# EAGLE design boxiangf-TH (EAGLE 9.6.2)
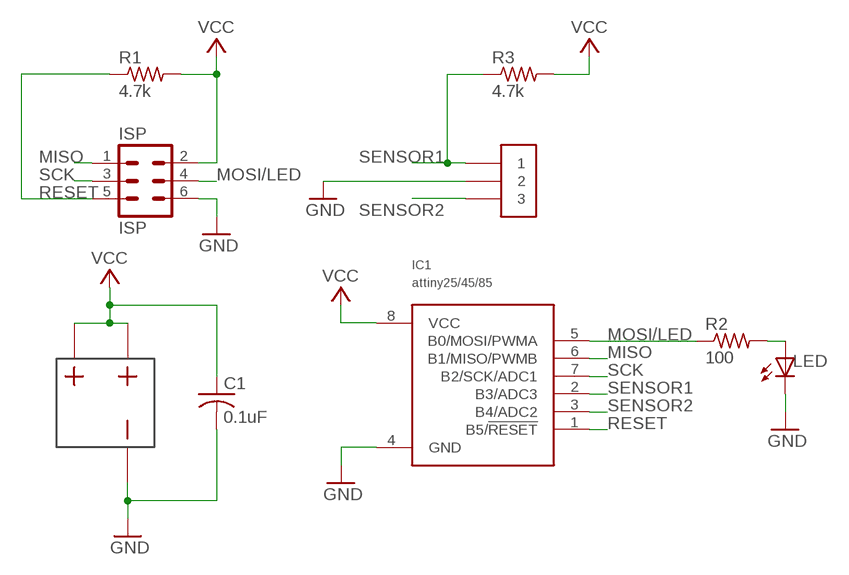
[diagram p0: schematic, sheet 1]

## Parts
C1  0.1uF  CAPACITORTH_CAP  [C025-025X050]
IC1  attiny25/45/85  ATTINY25TH_ATTINY  [DIL08]
ISP  ISP  6PINCON_ISPTH_6PIN  [6P2R0.1IN]
LED  LEDTH_LED  [LED5MM]
R1  4.7k  RESISTORTH_RESISTOR  [0204/7]
R2  100  RESISTORTH_RESISTOR  [0204/7]
R3  4.7k  RESISTORTH_RESISTOR  [0204/7]
SENSE  3PINCONTH_3PIN  [PUSHCON3]
US1  BATTERYTH_BA2032  [BA2032]

## Nets
GND: C1.2 IC1.4(GND) ISP.6 LED.K(C) SENSE.2 US1.P$1
MISO: IC1.6(B1/MISO/PWMB) ISP.1
MOSI/LED: IC1.5(B0/MOSI/PWMA) ISP.4 R2.1
N$2: LED.A R2.2
RESET: IC1.1(B5/!RESET) ISP.5 R1.1
SCK: IC1.7(B2/SCK/ADC1) ISP.3
SENSOR1: IC1.2(B3/ADC3) R3.1 SENSE.1
SENSOR2: IC1.3(B4/ADC2) SENSE.3
VCC: C1.1 IC1.8(VCC) ISP.2 R1.2 R3.2 US1.P$2 US1.P$3

## Library data of the parts
C1 = TinyGadget:CAPACITOR
IC1 = TinyGadget:ATTINY25
ISP = TinyGadget:6PINCON_ISP
LED = TinyGadget:LED
R1-R3 = TinyGadget:RESISTOR
SENSE = TinyGadget:3PINCON
US1 = TinyGadget:BATTERY

## Board
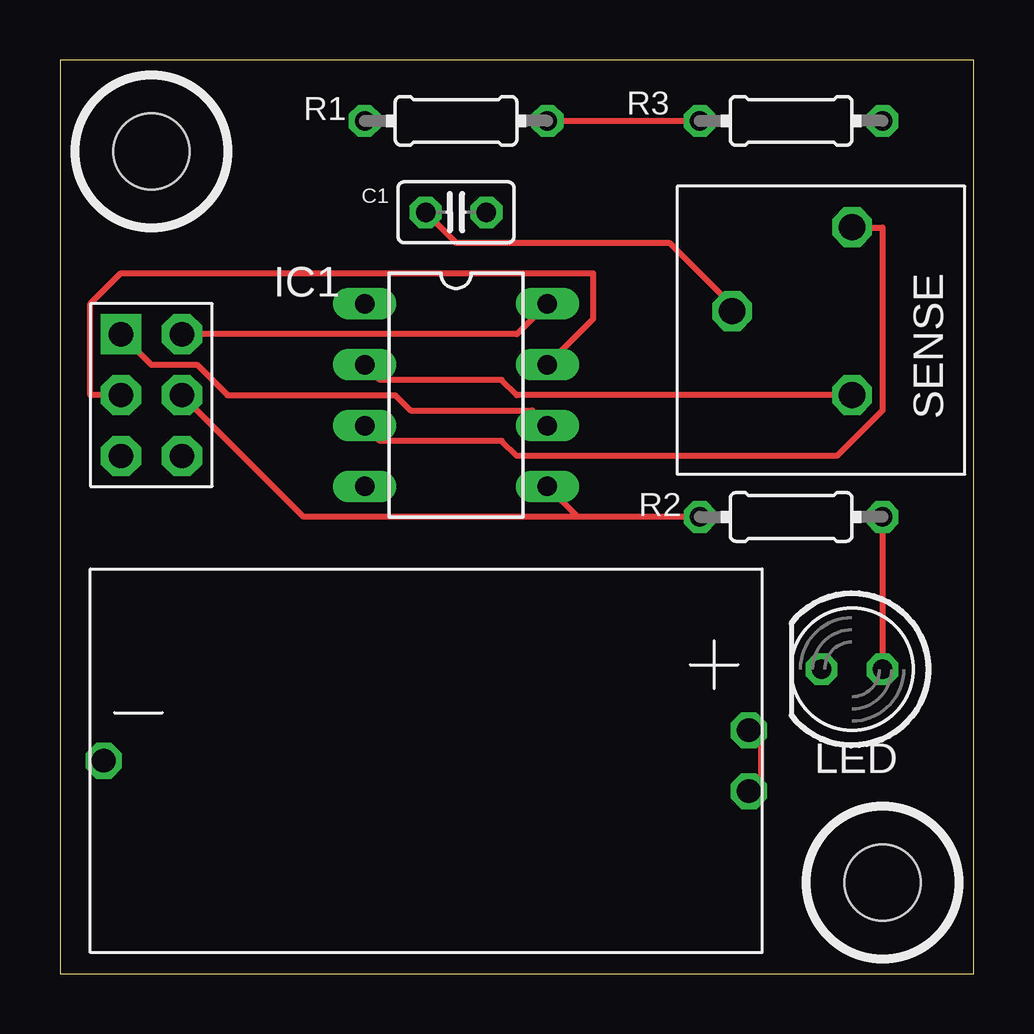
[diagram p1: board, top side]
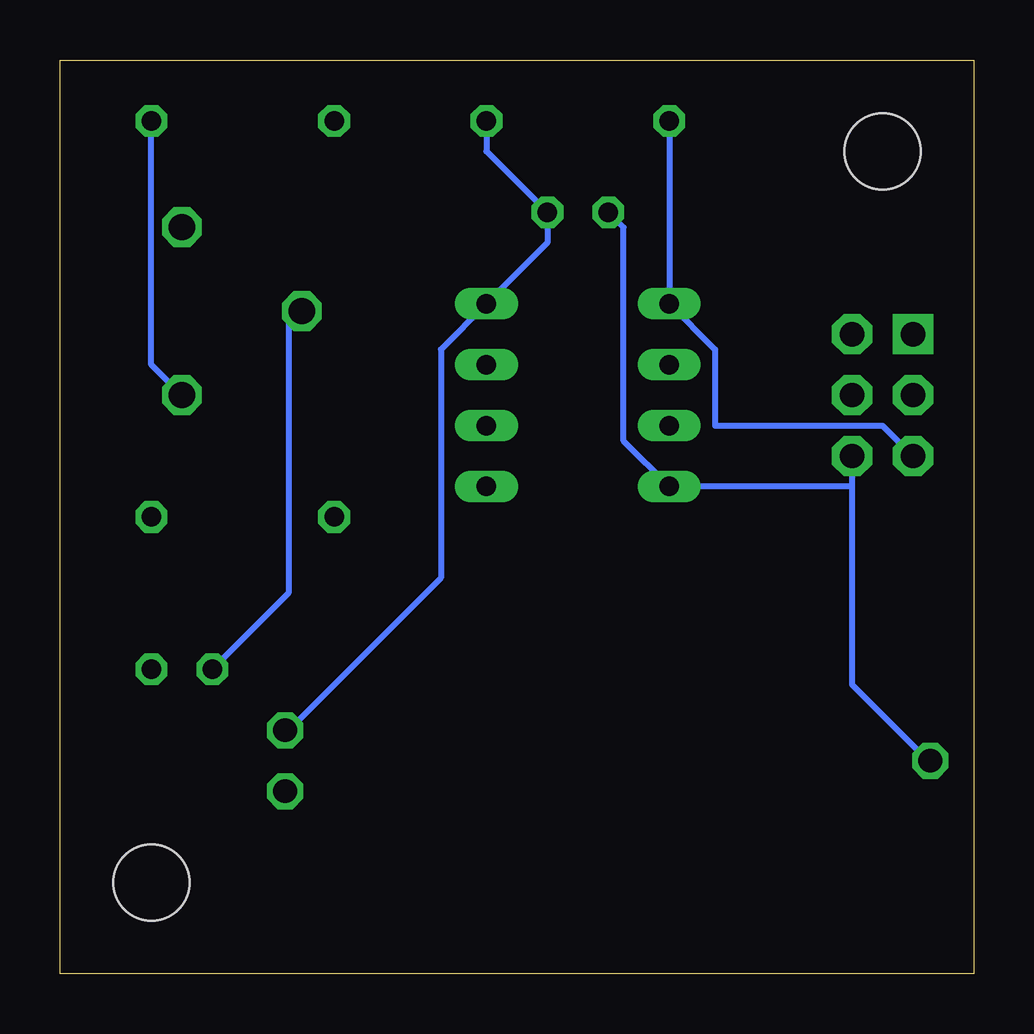
[diagram p2: board, bottom side, seen from below]

Size 38.1 x 38.1 mm. Coordinates in mm from the lower left corner, seen from the top.
Outline: 0,0 38.1,0 38.1,38.1 0,38.1 0,0
Copper layers (1*16): Top 0.035mm / dielectric 1.5mm / Bottom 0.035mm
Design rules "default": minimum track width 6mil, minimum drill 0.35mm, track to track 6mil, track to pad 6mil, pad to pad 6mil, via to via 6mil, smd to smd 6mil, copper to edge 40mil, drill to drill 6mil, minimum pad ring 10mil, minimum via ring 8mil, stop-mask expansion 4mil, vias tented up to drill 0mil, thermal gap 10mil
Holes 3.17 mm at 3.81,34.29 34.29,3.81

### Footprints (pad centres in the part's own frame; a part is rotated, then mirrored left to right if it is on the bottom)
C025-025X050 = drill 0.813 octagon: 1 -1.27,0; 2 1.27,0
DIL08 = drill 0.813 long: 1 -3.81,-3.81; 2 -1.27,-3.81; 3 1.27,-3.81; 4 3.81,-3.81; 5 3.81,3.81; 6 1.27,3.81; 7 -1.27,3.81; 8 -3.81,3.81
6P2R0.1IN = drill 1.016 pad 1.676 square: 1 0,0 | drill 1.016 pad 1.676 octagon: 2 0,2.54; 3 2.54,0; 4 2.54,2.54; 5 5.08,0; 6 5.08,2.54
LED5MM = drill 0.813 octagon: A -1.27,0; K 1.27,0
0204/7 = drill 0.813 octagon: 1 -3.81,0; 2 3.81,0
PUSHCON3 = drill 1.1 octagon: 1 0,0; 2 3.5,5; 3 7,0
BA2032 = drill 0.991 octagon: P$1 0.55,0; P$2 27.45,1.27; P$3 27.45,-1.27

### Placement (x,y rotation side)
C1  16.51,31.75 180 top
IC1  16.51,24.13 270 top
ISP  2.54,26.67 270 top
LED  33.02,12.7 180 top
R1  16.51,35.56 0 top
R2  30.48,19.05 0 top
R3  30.48,35.56 180 top
SENSE  33.02,24.13 90 top
US1  1.27,8.89 0 top

### Tracks (layer width: path | path; a pad name or v marks a point on that pad's centre or on a via)
GND
  Top 0.152: 27.94,27.94 SENSE.2
  Top 0.254: 27.94,27.94 25.4,30.48 16.51,30.48 C1.2
  Bottom 0.152: 28.57,27.3 SENSE.2 | 1.91,8.89 US1.P$1
  Bottom 0.254: LED.K 28.57,15.88 28.57,27.3 | 5.08,20.32 IC1.4 14.61,22.23 14.61,31.11 C1.2 | ISP.6 5.08,20.32 | 1.91,8.89 5.08,12.06 5.08,20.32
MISO
  Top 0.254: IC1.6 19.68,23.5 14.61,23.5 13.97,24.13 6.99,24.13 5.71,25.4 3.81,25.4 ISP.1
MOSI/LED
  Top 0.254: 21.59,19.05 IC1.5 | R2.1 21.59,19.05 | ISP.4 10.16,19.05 21.59,19.05
N$2
  Top 0.254: R2.2 LED.A
RESET
  Bottom 0.254: R1.1 IC1.1 10.79,26.04 10.79,22.86 3.81,22.86 ISP.5
SCK
  Top 0.254: IC1.7 22.23,27.3 22.23,29.21 2.54,29.21 1.27,27.94 1.27,24.13 ISP.3
SENSOR1
  Top 0.254: IC1.2 13.34,24.77 18.41,24.77 19.05,24.13 SENSE.1
  Bottom 0.254: R3.1 34.29,25.4 SENSE.1
SENSOR2
  Top 0.152: 33.02,31.11 SENSE.3
  Top 0.254: IC1.3 13.34,22.23 18.41,22.23 19.05,21.59 32.38,21.59 34.29,23.5 34.29,31.11 33.02,31.11
VCC
  Top 0.254: US1.P$3 29.21,7.62 29.21,10.16 US1.P$2 | R1.2 R3.2 | ISP.2 19.05,26.67 IC1.8
  Bottom 0.254: R1.2 20.32,34.29 C1.1 17.78,30.48 IC1.8 22.23,26.04 22.23,16.51 28.57,10.16 US1.P$2